# Altium project stm32.PrjPCB
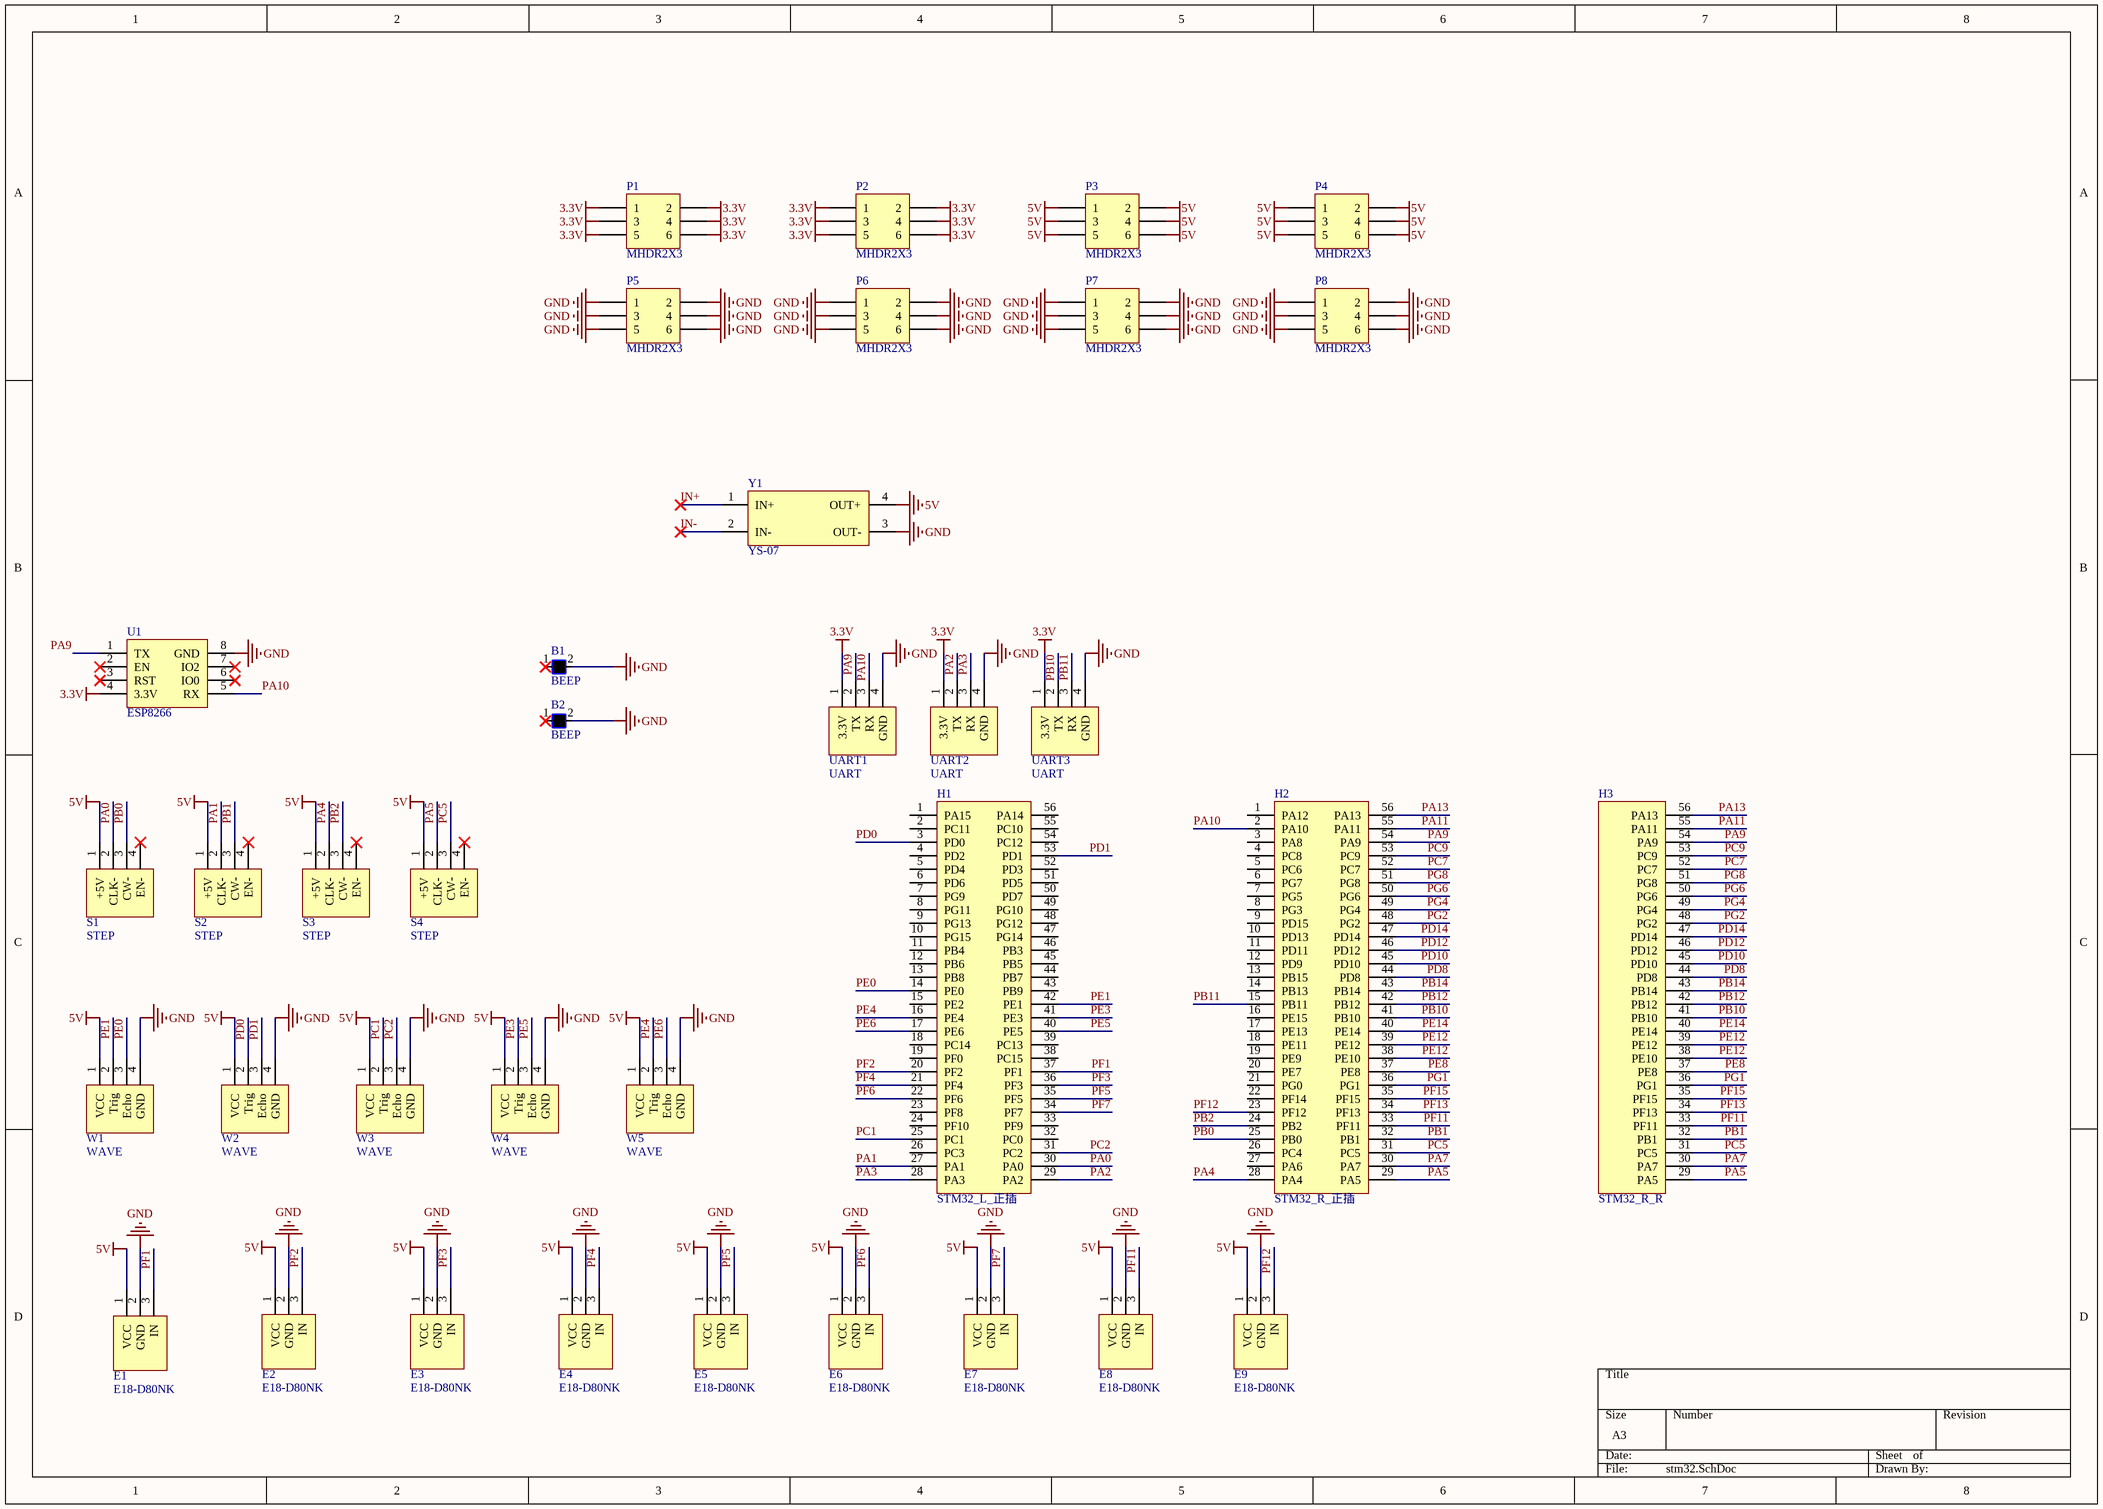
[diagram p0: stm32.SchDoc]
1 sheet, 36 parts. Net scope: global (net labels, ports and power ports of the same name join across sheets).
Board file: stm32.PcbDoc

## Sheet stm32.SchDoc
size A3

### Parts
B1  BEEP  [BEEP]
B2  BEEP  [BEEP]
E1  E18-D80NK  [E18]
E2  E18-D80NK  [E18]
E3  E18-D80NK  [E18]
E4  E18-D80NK  [E18]
E5  E18-D80NK  [E18]
E6  E18-D80NK  [E18]
E7  E18-D80NK  [E18]
E8  E18-D80NK  [E18]
E9  E18-D80NK  [E18]
H1  STM32_L_正插  [Header2*28]
H2  STM32_R_正插  [Header2*28]
H3  STM32_R_R  [HEADER1*28]
P1  MHDR2X3  [MHDR2X3]
P2  MHDR2X3  [MHDR2X3]
P3  MHDR2X3  [MHDR2X3]
P4  MHDR2X3  [MHDR2X3]
P5  MHDR2X3  [MHDR2X3]
P6  MHDR2X3  [MHDR2X3]
P7  MHDR2X3  [MHDR2X3]
P8  MHDR2X3  [MHDR2X3]
S1  STEP  [STEP]
S2  STEP  [STEP]
S3  STEP  [STEP]
S4  STEP  [STEP]
U1  ESP8266  [ESP8266]
UART1  UART  [UART]
UART2  UART  [UART]
UART3  UART  [UART]
W1  WAVE  [WAVE1*4]
W2  WAVE  [WAVE1*4]
W3  WAVE  [WAVE1*4]
W4  WAVE  [WAVE1*4]
W5  WAVE  [WAVE1*4]
Y1  YS-07  [YS-07]

### Nets
3.3V: P1.1 P1.2 P1.3 P1.4 P1.5 P1.6 P2.1 P2.2 P2.3 P2.4 P2.5 P2.6 U1.4(3.3V) UART1.1(3.3V) UART2.1(3.3V) UART3.1(3.3V)
5V: E1.1(VCC) E2.1(VCC) E3.1(VCC) E4.1(VCC) E5.1(VCC) E6.1(VCC) E7.1(VCC) E8.1(VCC) E9.1(VCC) P3.1 P3.2 P3.3 P3.4 P3.5 P3.6 P4.1 P4.2 P4.3 P4.4 P4.5 P4.6 S1.1(+5V) S2.1(+5V) S3.1(+5V) S4.1(+5V) W1.1(VCC) W2.1(VCC) W3.1(VCC) W4.1(VCC) W5.1(VCC) Y1.4(OUT+)
GND: B1.2(GND) B2.2(GND) E1.2(GND) E2.2(GND) E3.2(GND) E4.2(GND) E5.2(GND) E6.2(GND) E7.2(GND) E8.2(GND) E9.2(GND) P5.1 P5.2 P5.3 P5.4 P5.5 P5.6 P6.1 P6.2 P6.3 P6.4 P6.5 P6.6 P7.1 P7.2 P7.3 P7.4 P7.5 P7.6 P8.1 P8.2 P8.3 P8.4 P8.5 P8.6 U1.8(GND) UART1.4(GND) UART2.4(GND) UART3.4(GND) W1.4(GND) W2.4(GND) W3.4(GND) W4.4(GND) W5.4(GND) Y1.3(OUT-)
IN+: Y1.1(IN+)
IN-: Y1.2(IN-)
PA0: H1.30(PA0) S1.2(CLK-)
PA1: H1.27(PA1) S2.2(CLK-)
PA2: H1.29(PA2) UART2.2(TX)
PA3: H1.28(PA3) UART2.3(RX)
PA4: H2.28(PA4) S3.2(CLK-)
PA5: H2.29(PA5) H3.29(PA5) S4.2(CLK-)
PA7: H2.30(PA7) H3.30(PA7)
PA9: H2.54(PA9) H3.54(PA9) U1.1(TX) UART1.2(TX)
PA10: H2.2(PA10) U1.5(RX) UART1.3(RX)
PA11: H2.55(PA11) H3.55(PA11)
PA13: H2.56(PA13) H3.56(PA13)
PB0: H2.25(PB0) S1.3(CW-)
PB1: H2.32(PB1) H3.32(PB1) S2.3(CW-)
PB2: H2.24(PB2) S3.3(CW-)
PB10: H2.41(PB10) H3.41(PB10) UART3.2(TX)
PB11: H2.15(PB11) UART3.3(RX)
PB12: H2.42(PB12) H3.42(PB12)
PB14: H2.43(PB14) H3.43(PB14)
PC1: H1.25(PC1) W3.2(Trig)
PC2: H1.31(PC2) W3.3(Echo)
PC5: H2.31(PC5) H3.31(PC5) S4.3(CW-)
PC7: H2.52(PC7) H3.52(PC7)
PC9: H2.53(PC9) H3.53(PC9)
PD0: H1.3(PD0) W2.2(Trig)
PD1: H1.53(PD1) W2.3(Echo)
PD8: H2.44(PD8) H3.44(PD8)
PD10: H2.45(PD10) H3.45(PD10)
PD12: H2.46(PD12) H3.46(PD12)
PD14: H2.47(PD14) H3.47(PD14)
PE0: H1.14(PE0) W1.3(Echo)
PE1: H1.42(PE1) W1.2(Trig)
PE3: H1.41(PE3) W4.2(Trig)
PE4: H1.16(PE4) W5.2(Trig)
PE5: H1.40(PE5) W4.3(Echo)
PE6: H1.17(PE6) W5.3(Echo)
PE8: H2.37(PE8) H3.37(PE8)
PE12: H2.38(PE10) H2.39(PE12) H3.38(PE10) H3.39(PE12)
PE14: H2.40(PE14) H3.40(PE14)
PF1: E1.3(IN) H1.37(PF1)
PF2: E2.3(IN) H1.20(PF2)
PF3: E3.3(IN) H1.36(PF3)
PF4: E4.3(IN) H1.21(PF4)
PF5: E5.3(IN) H1.35(PF5)
PF6: E6.3(IN) H1.22(PF6)
PF7: E7.3(IN) H1.34(PF7)
PF11: E8.3(IN) H2.33(PF11) H3.33(PF11)
PF12: E9.3(IN) H2.23(PF12)
PF13: H2.34(PF13) H3.34(PF13)
PF15: H2.35(PF15) H3.35(PF15)
PG1: H2.36(PG1) H3.36(PG1)
PG2: H2.48(PG2) H3.48(PG2)
PG4: H2.49(PG4) H3.49(PG4)
PG6: H2.50(PG6) H3.50(PG6)
PG8: H2.51(PG8) H3.51(PG8)

Not connected (* = marked no-connect by the designer): B1 1(IN)*; B2 1(IN)*; H1 1(PA15) 2(PC11) 4(PD2) 5(PD4) 6(PD6) 7(PG9) 8(PG11) 9(PG13) 10(PG15) 11(PB4) 12(PB6) 13(PB8) 15(PE2) 18(PC14) 19(PF0) 23(PF8) 24(PF10) 26(PC3) 32(PC0) 33(PF9) 38(PC15) 39(PC13) 43(PB9) 44(PB7) 45(PB5) 46(PB3) 47(PG14) 48(PG12) 49(PG10) 50(PD7) 51(PD5) 52(PD3) 54(PC12) 55(PC10) 56(PA14); H2 1(PA12) 3(PA8) 4(PC8) 5(PC6) 6(PG7) 7(PG5) 8(PG3) 9(PD15) 10(PD13) 11(PD11) 12(PD9) 13(PB15) 14(PB13) 16(PE15) 17(PE13) 18(PE11) 19(PE9) 20(PE7) 21(PG0) 22(PF14) 26(PC4) 27(PA6); S1 4(EN-)*; S2 4(EN-)*; S3 4(EN-)*; S4 4(EN-)*; U1 2(EN)* 3(RST)* 6(IO0)* 7(IO2)*

### Library data of the parts
P1-P8 = MHDR2X3: Header, 3-Pin, Dual row; LatestRevisionDate: 17-Jul-2002; LatestRevisionNote: Re-released for DXP Platform.; Publisher: Altium Limited